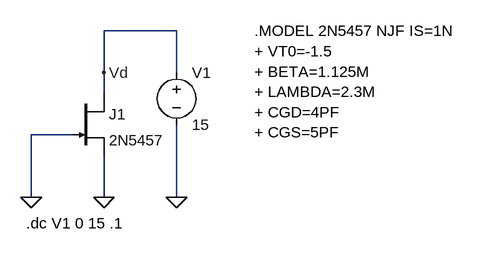
[diagram p0: schematic ej1.asc]
ej1.asc, the LTspice schematic file:
Version 4.1
SHEET 1 1460 680
WIRE 320 0 208 0
WIRE 208 64 208 0
WIRE 320 64 320 0
WIRE 208 96 208 64
WIRE 160 160 96 160
WIRE 96 256 96 160
WIRE 208 256 208 192
WIRE 320 256 320 144
FLAG 208 256 0
FLAG 96 256 0
FLAG 320 256 0
FLAG 208 64 Vd
SYMBOL njf 160 96 R0
SYMATTR InstName J1
SYMATTR Value 2N5457
SYMBOL voltage 320 48 R0
WINDOW 123 0 0 Left 0
WINDOW 39 0 0 Left 0
SYMATTR InstName V1
SYMATTR Value 15
TEXT 440 0 Left 2 !.MODEL 2N5457 NJF IS=1N \n+ VT0=-1.5\n+ BETA=1.125M\n+ LAMBDA=2.3M\n+ CGD=4PF\n+ CGS=5PF
TEXT 88 296 Left 2 !.dc V1 0 15 .1

The netlist it stands for:
* ej1.asc
J1 Vd 0 0 2N5457
V1 Vd 0 15
.model NJF NJF
.model PJF PJF
.lib standard.jft
.MODEL 2N5457 NJF IS=1N
+ VT0=-1.5
+ BETA=1.125M
+ LAMBDA=2.3M
+ CGD=4PF
+ CGS=5PF
.dc V1 0 15 .1
.backanno
.end